# EAGLE design miniframe (EAGLE 5.10)
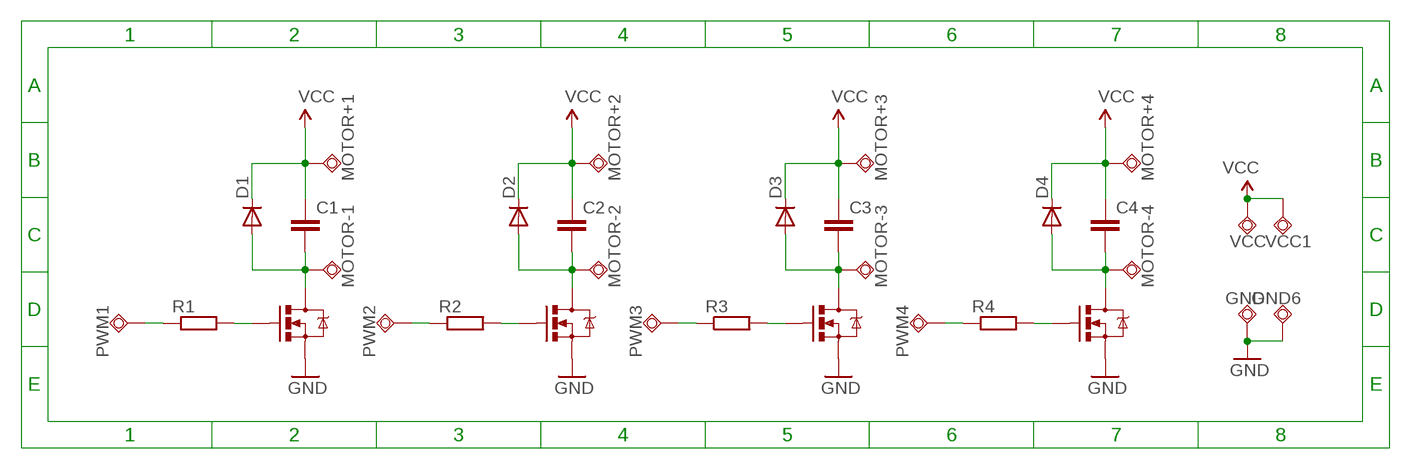
[diagram p0: schematic, sheet 1]

## Parts
C1  C-EUC0805  [C0805]
C2  C-EUC0805  [C0805]
C3  C-EUC0805  [C0805]
C4  C-EUC0805  [C0805]
D1  PMLL4150  [SOD80C]
D2  PMLL4150  [SOD80C]
D3  PMLL4150  [SOD80C]
D4  PMLL4150  [SOD80C]
GND  TPSQTP14SQ  [TP14SQ]
GND6  TPSQTP14SQ  [TP14SQ]
MOTOR+1  TPSQTP14SQ  [TP14SQ]
MOTOR+2  TPSQTP14SQ  [TP14SQ]
MOTOR+3  TPSQTP14SQ  [TP14SQ]
MOTOR+4  TPSQTP14SQ  [TP14SQ]
MOTOR-1  TPSQTP14SQ  [TP14SQ]
MOTOR-2  TPSQTP14SQ  [TP14SQ]
MOTOR-3  TPSQTP14SQ  [TP14SQ]
MOTOR-4  TPSQTP14SQ  [TP14SQ]
PWM1  TPSQTP14SQ  [TP14SQ]
PWM2  TPSQTP14SQ  [TP14SQ]
PWM3  TPSQTP14SQ  [TP14SQ]
PWM4  TPSQTP14SQ  [TP14SQ]
Q1  MOSFET-NCHANNELSMD  [SOT23-3]
Q2  MOSFET-NCHANNELSMD  [SOT23-3]
Q3  MOSFET-NCHANNELSMD  [SOT23-3]
Q4  MOSFET-NCHANNELSMD  [SOT23-3]
R1  R-EU_M0805  [M0805]
R2  R-EU_M0805  [M0805]
R3  R-EU_M0805  [M0805]
R4  R-EU_M0805  [M0805]
VCC  TPSQTP14SQ  [TP14SQ]
VCC1  TPSQTP14SQ  [TP14SQ]

## Nets
GND: GND6.TP GND.TP Q1.2(S) Q2.2(S) Q3.2(S) Q4.2(S)
N$1: C2.2 D2.A MOTOR-2.TP Q2.3(D)
N$2: C1.2 D1.A MOTOR-1.TP Q1.3(D)
N$3: Q2.1(G) R2.2
N$4: Q1.1(G) R1.2
N$5: PWM1.TP R1.1
N$6: PWM2.TP R2.1
N$7: C3.2 D3.A MOTOR-3.TP Q3.3(D)
N$8: Q3.1(G) R3.2
N$9: PWM3.TP R3.1
N$10: C4.2 D4.A MOTOR-4.TP Q4.3(D)
N$11: Q4.1(G) R4.2
N$12: PWM4.TP R4.1
VCC: C1.1 C2.1 C3.1 C4.1 D1.C D2.C D3.C D4.C MOTOR+1.TP MOTOR+2.TP MOTOR+3.TP MOTOR+4.TP VCC1.TP VCC.TP

## Library data of the parts
C1-C4 = rcl:C-EU: CAPACITOR, European symbol
D1-D4 = diode:PMLL4150: DIODE high speed
GND GND6 MOTOR+1-MOTOR+4 MOTOR-1-MOTOR-4 PWM1-PWM4 VCC VCC1 = testpad:TPSQ: Test pad
Q1-Q4 = SparkFun:MOSFET-NCHANNEL
R1-R4 = resistor:R-EU_: RESISTOR, European symbol

## Board
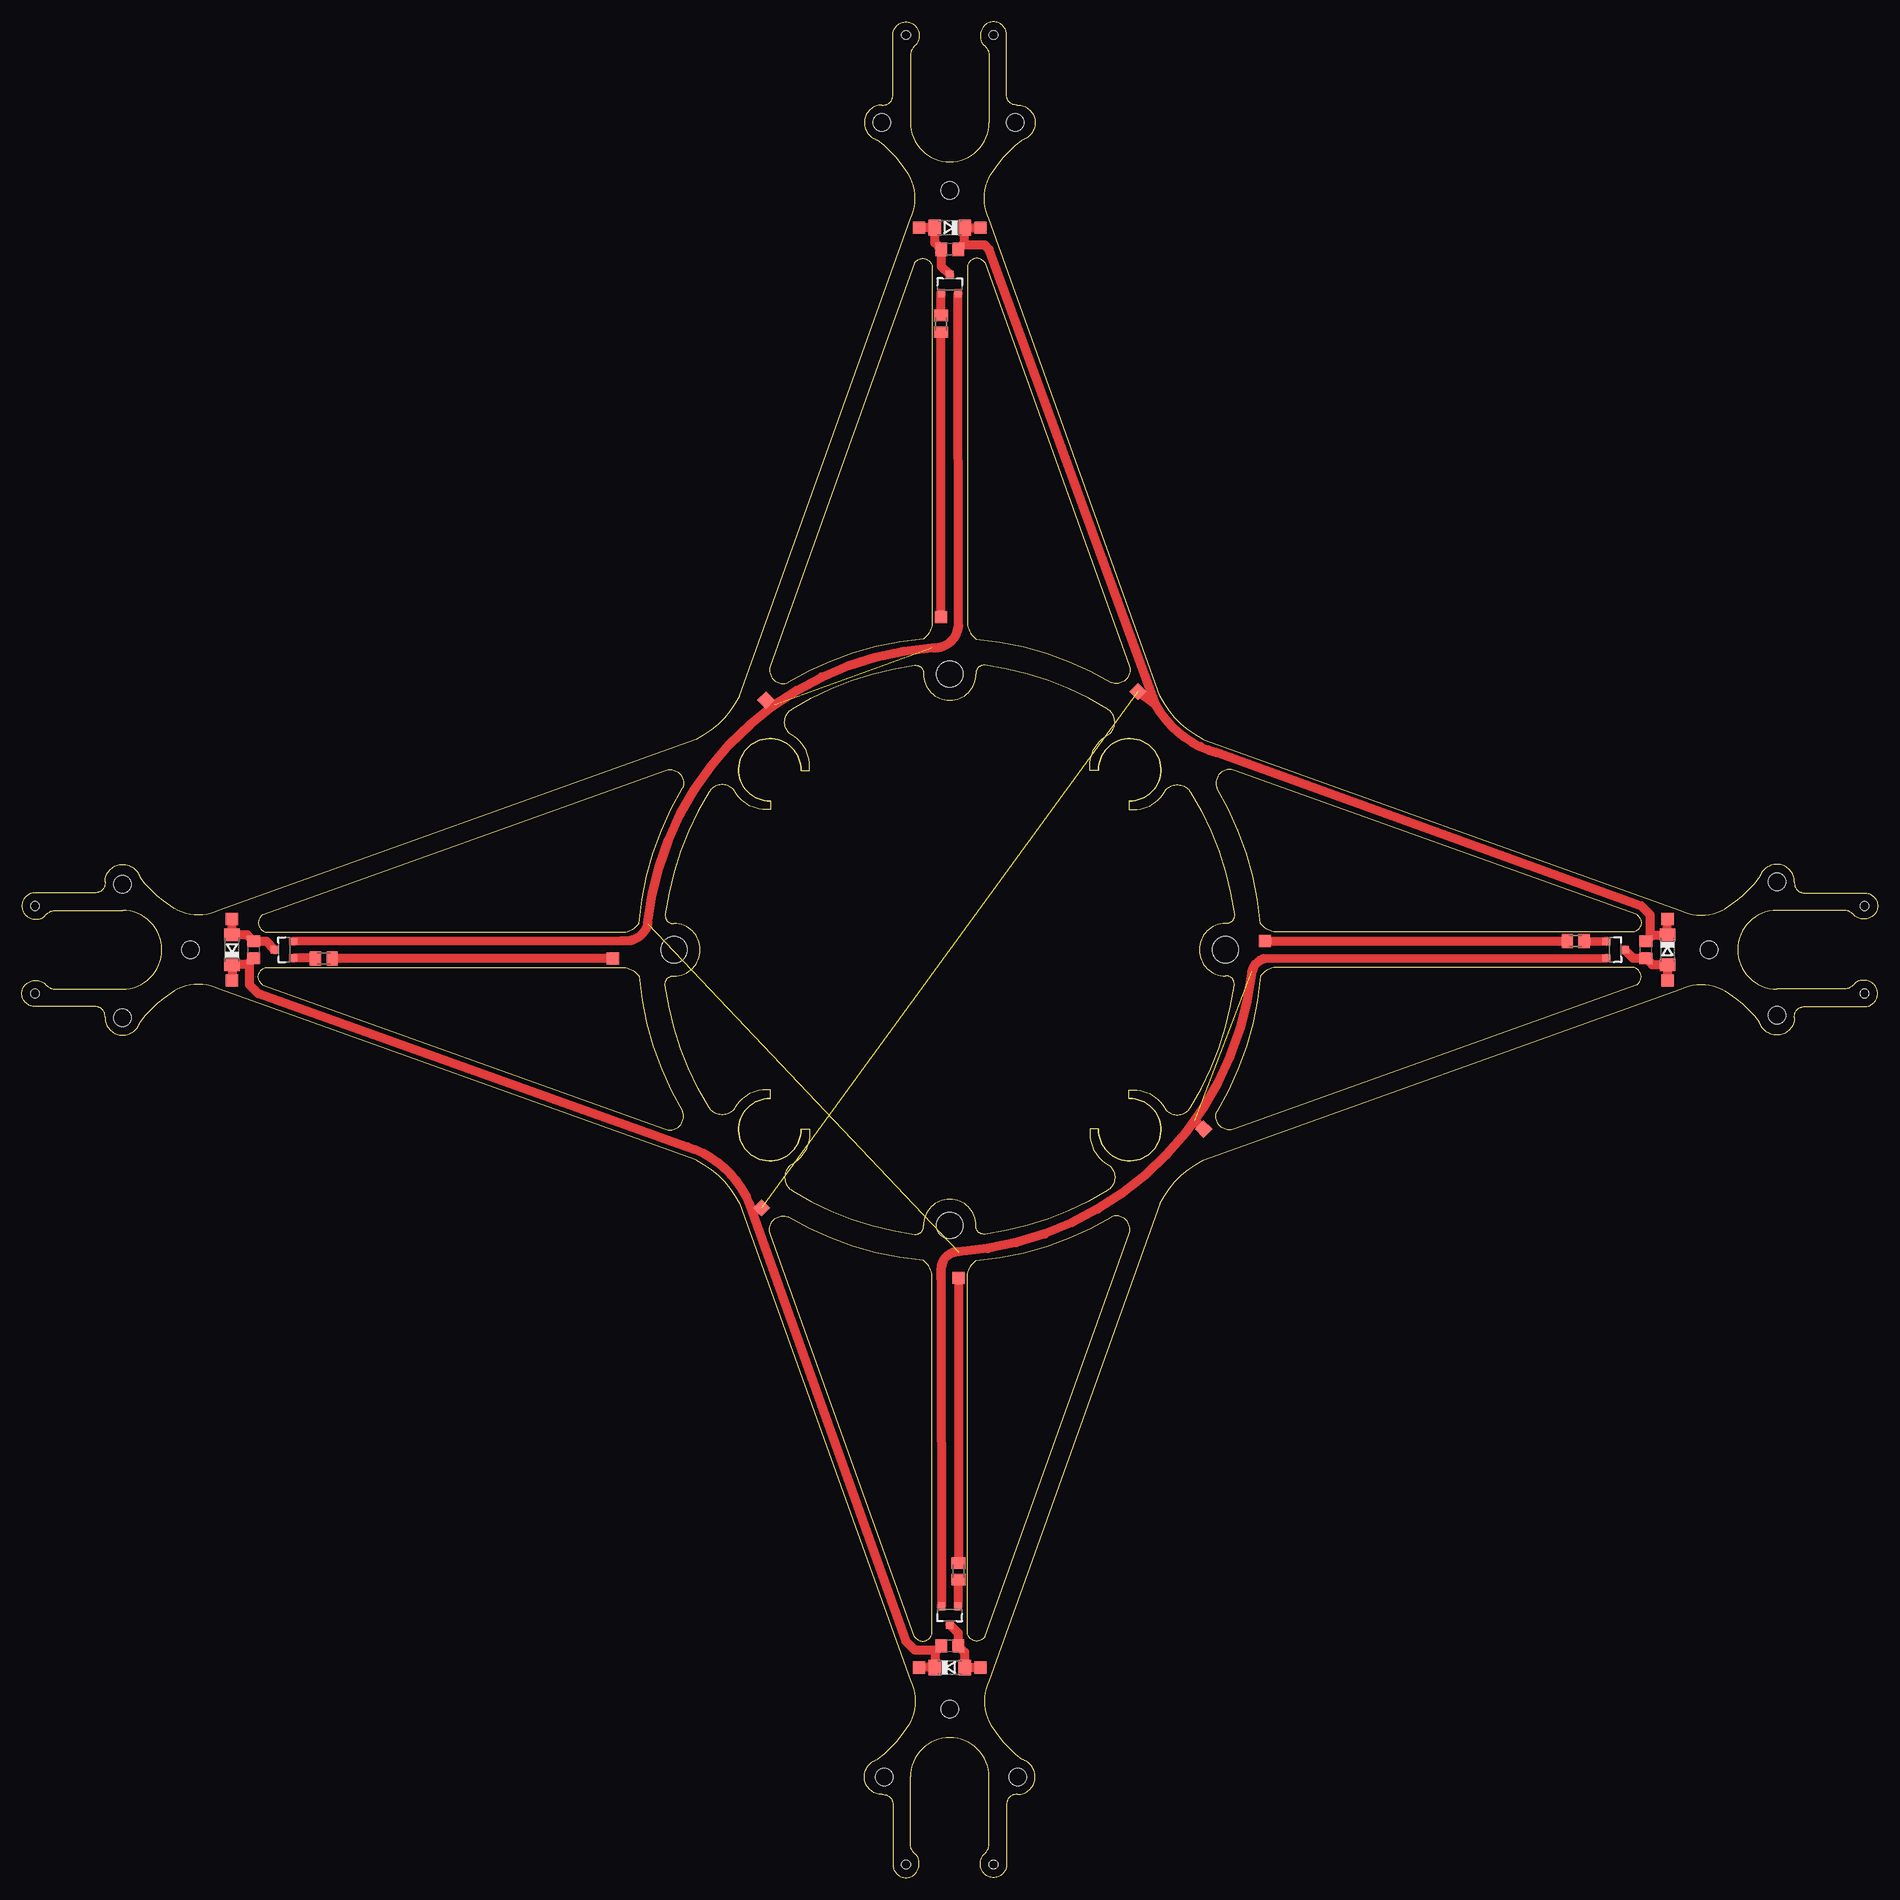
[diagram p1: board, top side]

Size 212 x 212 mm. Coordinates in mm from the lower left corner, seen from the top.
Outline: 85.5,123 arc-272 89,126.5
Outline: 85.5,123 85.5,122 85,122 arc-59 81.5,124 arc119 78.5,124 arc24 73.5,110 arc103 74.5,109 arc-180 74.5,103 arc103 73.5,102 arc24 78.5,88 arc119 81.5,88 arc-59 85,90 85.5,90 85.5,89
Outline: 85.5,89 arc272 89,85.5
Outline: 89,85.5 arc-272 85.5,89
Outline: 89,85.5 90,85.5 90,85 arc-59 88,81.5 arc119 88,78.5 arc24 102,73.5 arc103 103,74.5 arc-180 109,74.5 arc103 110,73.5 arc24 124,78.5 arc119 124,81.5 arc-59 122,85 122,85.5 123,85.5
Outline: 123,85.5 arc272 126.5,89
Outline: 126.5,89 arc-272 123,85.5
Outline: 126.5,89 126.5,90 127,90 arc-59 130.5,88 arc119 133.5,88 arc24 138.5,102 arc103 137.5,103 arc-180 137.5,109 arc103 138.5,110 arc24 133.5,124 arc119 130.5,124 arc-59 127,122 126.5,122 126.5,123
Outline: 126.5,123 arc272 123,126.5
Outline: 123,126.5 arc-272 126.5,123
Outline: 123,126.5 122,126.5 122,127 arc-59 124,130.5 arc119 124,133.5 arc24 110,138.5 arc103 109,137.5 arc-180 103,137.5 arc103 102,138.5 arc24 88,133.5 arc119 88,130.5 arc-59 90,127 90,126.5 89,126.5
Outline: 89,126.5 arc272 85.5,123
Outline: 28,108 68.5,108 arc53 70.5,109 arc-26 75.5,124.5 arc129 73.5,126.5 27.5,110 arc141 28,108
Outline: 77,130 22.5,110.5 arc-62 17,111 arc-18 13.5,114.25 arc74 11.5,115.75 arc90 9.5,113.75 arc-90 8.5,112.5 1.5,112.5 arc90 0,111 arc90 1.5,109.5 1.75,109.5 arc53 2.75,110 arc-53 4,110.5 11.5,110.5 arc-180 11.5,101.5 4,101.5 arc-53 2.75,102 arc53 1.5,102.5 arc90 0,101 arc90 1.5,99.5 8.5,99.5 arc-90 9.5,98.25 arc90 11.5,96.25 arc74 13.5,97.75 arc-18 17,101 arc-62 22.5,101.5 77,82 arc-36 82,77 101.5,22.5 arc-62 101,17 arc-18 97.75,13.5 arc74 96.25,11.5 arc90 98.25,9.5 arc-90 99.5,8.5 99.5,1.5 arc90 101,0 arc90 102.5,1.5 102.5,1.75 arc53 102,2.75 arc-53 101.5,4 101.5,11.5 arc-180 110.5,11.5 110.5,4 arc-53 110,2.75 arc53 109.5,1.5 arc90 111,0 arc90 112.5,1.5 112.5,8.5 arc-90 113.75,9.5 arc90 115.75,11.5 arc74 114.25,13.5 arc-18 111,17 arc-62 110.5,22.5 130,77 arc-36 135,82 189.5,101.5 arc-62 195,101 arc-18 198.5,97.75 arc74 200.5,96.25 arc90 202.5,98.25 arc-90 203.5,99.5 210.5,99.5 arc90 212,101 arc90 210.5,102.5 210.25,102.5 arc53 209.25,102 arc-53 208,101.5 200.5,101.5 arc-180 200.5,110.5 208,110.5 arc-53 209.25,110 arc53 210.5,109.5 arc90 212,111 arc90 210.5,112.5 203.5,112.5 arc-90 202.5,113.75 arc90 200.5,115.75 arc74 198.5,114.25 arc-18 195,111 arc-62 189.5,110.5 135,130 arc-36 130,135 110.5,189.5 arc-62 111,195 arc-18 114.25,198.5 arc74 115.75,200.5 arc90 113.75,202.5 arc-90 112.5,203.5 112.5,210.5 arc90 111,212 arc90 109.5,210.5 109.5,210.25 arc53 110,209.25 arc-53 110.5,208 110.5,200.5 arc-180 101.5,200.5 101.5,208 arc-53 102,209.25 arc53 102.5,210.5 arc90 101,212 arc90 99.5,210.5 99.5,203.5 arc-90 98.25,202.5 arc90 96.25,200.5 arc74 97.75,198.5 arc-18 101,195 arc-62 101.5,189.5 82,135 arc-36 77,130
Outline: 28,104 68.5,104 arc-53 70.5,103 arc26 75.5,87.5 arc-129 73.5,85.5 27.5,102 arc-141 28,104
Outline: 104,28 104,68.5 arc53 103,70.5 arc-26 87.5,75.5 arc129 85.5,73.5 102,27.5 arc141 104,28
Outline: 108,28 108,68.5 arc-53 109,70.5 arc26 124.5,75.5 arc-129 126.5,73.5 110,27.5 arc-141 108,28
Outline: 184,104 143.5,104 arc53 141.5,103 arc-26 136.5,87.5 arc129 138.5,85.5 184.5,102 arc141 184,104
Outline: 184,108 143.5,108 arc-53 141.5,109 arc26 136.5,124.5 arc-129 138.5,126.5 184.5,110 arc-141 184,108
Outline: 108,184 108,143.5 arc53 109,141.5 arc-26 124.5,136.5 arc129 126.5,138.5 110,184.5 arc141 108,184
Outline: 104,184 104,143.5 arc-53 103,141.5 arc26 87.5,136.5 arc-129 85.5,138.5 102,184.5 arc-141 104,184
Copper layers (1*16): Top 0.035mm / dielectric 1.5mm / Bottom 0.035mm
Design rules "default *": minimum track width 10mil, minimum drill 24mil, track to track 8mil, track to pad 8mil, pad to pad 8mil, via to via 8mil, smd to smd 8mil, copper to edge 1mil, drill to drill 8mil, minimum pad ring 10mil, minimum via ring 8mil, stop-mask expansion 4mil, vias tented up to drill 0mil, thermal gap 10mil
Holes 3 mm at 74.5,106 106,74.5 137.5,106 106,137.5
Holes 2 mm at 11.5,113.5 19.25,106 11.5,98.25 98.5,11.5 106,19.25 113.75,11.5 200.5,98.5 192.75,106 200.5,113.75 98.25,200.5 106,192.75 113.5,200.5
Holes 1 mm at 1.5,101 1.5,111 101,1.5 111,1.5 210.5,111 210.5,101 101,210.5 111,210.5

### Footprints (pad centres in the part's own frame; a part is rotated, then mirrored left to right if it is on the bottom)
C0805 = smd 1.3 x 1.5: 1 -0.95,0; 2 0.95,0
SOD80C = smd 1.4 x 1.8: A 1.7,0; C -1.7,0
TP14SQ = smd 1.4 x 1.4: TP 0,0
SOT23-3 = smd 0.8 x 0.9: 1 -0.95,-1; 2 0.95,-1; 3 0,1.1
M0805 = smd 1.3 x 1.6: 1 -0.95,0; 2 0.95,0

### Placement (x,y rotation side)
C1  26.5,106 90 top
C2  106,186 180 top
C3  106,26.5 0 top
C4  185.5,106 270 top
D1  24,106 90 top
D2  106,188.5 180 top
D3  106,24 0 top
D4  188,106 270 top
GND  135,85.5 45 top
GND6  85,134.5 45 top
MOTOR+1  24,102.5 0 top
MOTOR+2  109.5,188.5 0 top
MOTOR+3  102.5,24 0 top
MOTOR+4  188,109.5 0 top
MOTOR-1  24,109.5 0 top
MOTOR-2  102.5,188.5 0 top
MOTOR-3  109.5,24 0 top
MOTOR-4  188,102.5 0 top
PWM1  67.5,105 0 top
PWM2  105,144 0 top
PWM3  107,68.5 0 top
PWM4  142,107 0 top
Q1  30,106 90 top
Q2  106,182 0 top
Q3  106,30 180 top
Q4  182,106 270 top
R1  34.5,105 180 top
R2  105,177.5 90 top
R3  107,35 270 top
R4  177.5,107 0 top
VCC  84.5,76.5 45 top
VCC1  127.5,135.5 45 top

### Tracks (layer width: path | path; a pad name or v marks a point on that pad's centre or on a via)
GND  (3 unrouted)
  Top 1: Q2.2 107,143 arc-90 104,140.5 arc80 71.5,109 arc-78 69,107 arc0 68.5,107 Q1.2 | Q3.2 105,68.5 arc0 105,69.5 arc-90 107,71.5 arc80 140.5,103.5 arc-62 142,105 Q4.2 | GND.TP 134,86.5 | GND6.TP 86,134
N$1
  Top 1: MOTOR-2.TP D2.A 104.3,186.75 C2.2 105.05,184.05 Q2.3
N$2
  Top 1: Q1.3 27.95,106.95 C1.2 25.75,107.7 D1.A MOTOR-1.TP
N$3
  Top 1: R2.2 105,180.95 Q2.1
N$4
  Top 1: Q1.1 33.5,105.05 R1.2
N$5
  Top 1: PWM1.TP R1.1
N$6
  Top 1: PWM2.TP R2.1
N$7
  Top 1: MOTOR-3.TP D3.A 107.7,25.75 C3.2 106.95,27.95 Q3.3
N$8
  Top 1: Q3.1 106.95,34 R3.2
N$9
  Top 1: PWM3.TP R3.1
N$10
  Top 1: Q4.3 184.05,105.05 C4.2 186.25,104.3 D4.A MOTOR-4.TP
N$11
  Top 1: R4.2 Q4.1
N$12
  Top 1: PWM4.TP R4.1
VCC  (1 unrouted)
  Top 1: MOTOR+1.TP D1.C 25.75,104.3 C1.1 26.5,105 26,104.5 26,102 27,101 76,83.5 arc-55 83.5,76 | MOTOR+3.TP D3.C 104.3,25.75 C3.1 104.55,26 102,26 101,27 83.5,76 | MOTOR+4.TP D4.C 186.25,107.7 C4.1 186,107.45 186,110 185,111 136.5,128.5 arc-45 129.5,134 | MOTOR+2.TP D2.C 107.7,186.75 C2.1 107,186 107.5,186.5 110,186.5 110.5,186 129.5,134 | VCC.TP 83.5,76 | VCC1.TP 129.5,134